# Altium project Hall-effect_sensor_holder.PrjPcb
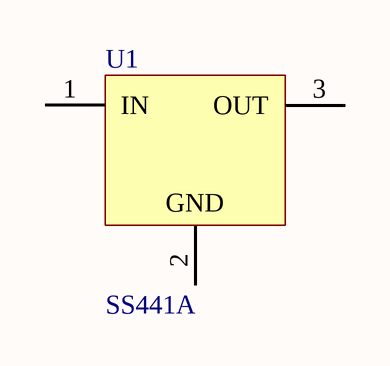
[diagram p0: Hall-effect_sensor_holder.SchDoc]
1 sheet, 1 parts. Net scope: global (net labels, ports and power ports of the same name join across sheets).
Board file: Hall-effect_sensor_holder.PcbDoc

## Sheet Hall-effect_sensor_holder.SchDoc: Hall-effect_sensor_holder
size A4; DrawnBy: Elias Zoller; SheetNumber: 1; SheetTotal: 1; ProjectName: ZARC_project

### Parts
U1  SS441A  [TO-92 Flat]

### Nets

Not connected (* = marked no-connect by the designer): U1 1(IN) 2(GND) 3(OUT)

### Library data of the parts
U1 = SS441A: Bipolar, Latching, or Unipolar Hall-effect Digital Sensor ICs